# EAGLE design bicyclelab-manager-v4.0 (EAGLE 6.5.0)
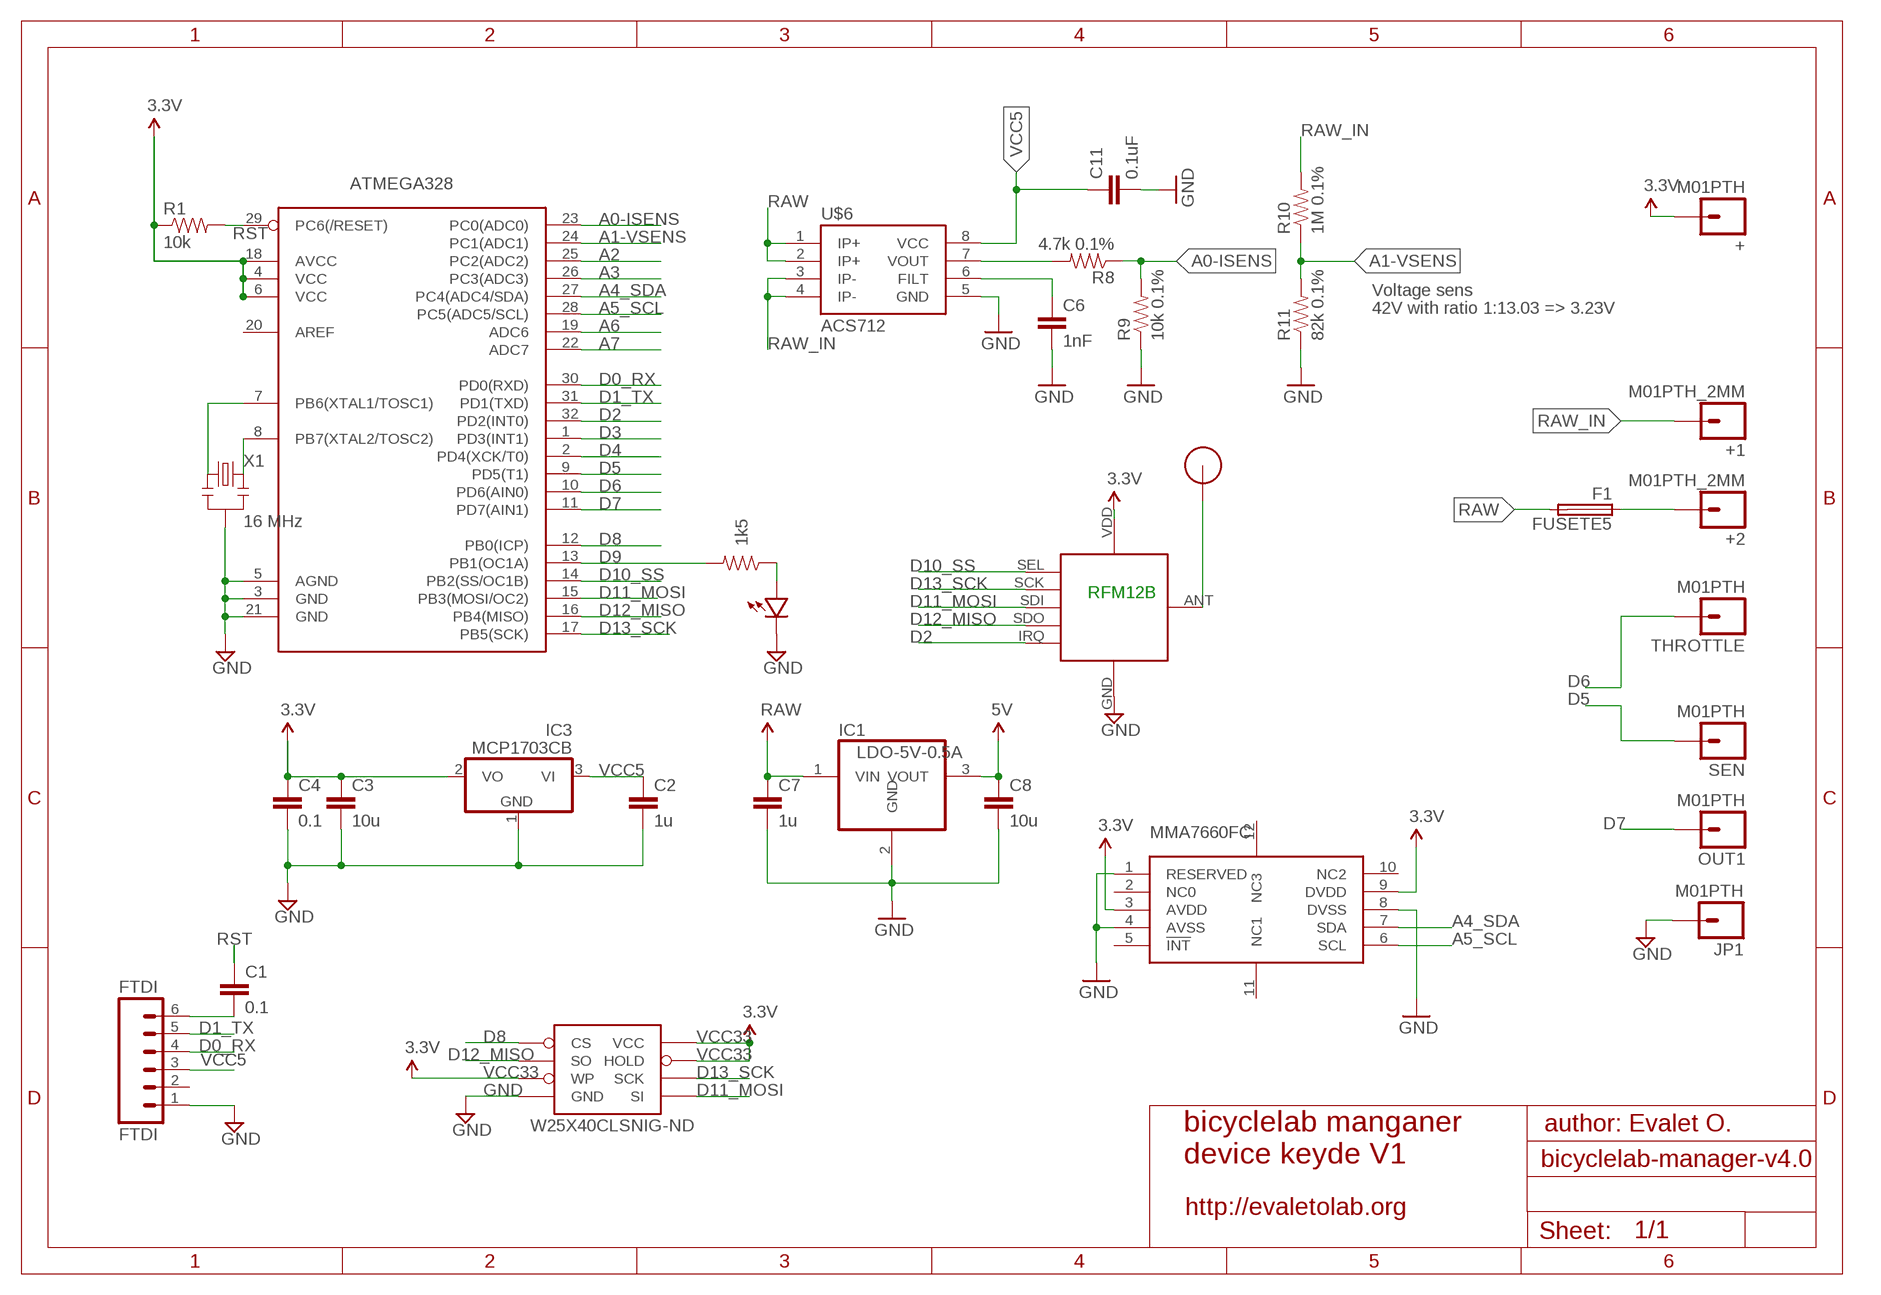
[diagram p0: schematic, sheet 1]

## Parts
+  M01PTH  [1X01]
+1  M01PTH_2MM  [1X01_2MM]
+2  M01PTH_2MM  [1X01_2MM]
ATMEGA328  ATMega-328  ATMEGA168/328TQFP32  [TQFP32-08]
C1  0.1  CAP0603-CAP  [0603-CAP]
C2  1u  CAP0603-CAP  [0603-CAP]
C3  10u  CAP0805-CAP  [0805-CAP]
C4  0.1  CAP0603-CAP  [0603-CAP]
C6  1nF  CAP0805  [0805]
C7  1u  CAP0603-CAP  [0603-CAP]
C8  10u  CAP0805-CAP  [0805-CAP]
C11  0.1uF  CAP0805  [0805]
F1  FUSETE5  [TE5]
FTDI  FTDI  M06SIP  [1X06]
IC1  LDO-5V-0.5A  [SOT223]
IC3  MCP1703CB  [SOT23]
JP1  M01PTH  [1X01]
MMA7660FC  MMA7660FC-DFN10  [DFN10]
OUT1  M01PTH  [1X01]
R1  10k  RESISTOR0603-RES  [0603-RES]
R2  1k5  RESISTOR0603-RES  [0603-RES]
R8  4.7k 0.1%  RESISTOR  [0805]
R9  10k 0.1%  RESISTOR  [0805]
R10  1M 0.1%  RESISTOR  [0805]
R11  82k 0.1%  RESISTOR  [0805]
RFM12B  RFM12B_MINPADS  [RFM12B-MINPADS]
SEN  M01PTH  [1X01]
THROTTLE  M01PTH  [1X01]
U$1  RFM12B_ANTENNA  [RFM12B-ANTENNA]
U$2  LED0603  [0603-LED]
U$6  ACS712  [SO08]
W25X40CLSNIG-ND  AT25F512BWIDE_5.3MM  [SO08WIDE]
X1  16 MHz  RESONATORSMD  [RESONATOR-SMD]

## Nets
A0-ISENS: ATMEGA328.23(PC0(ADC0)) R8.1 R9.2
A1-VSENS: ATMEGA328.24(PC1(ADC1)) R10.1 R11.2
A2: ATMEGA328.25(PC2(ADC2))
A3: ATMEGA328.26(PC3(ADC3))
A4_SDA: ATMEGA328.27(PC4(ADC4/SDA)) MMA7660FC.7(SDA)
A5_SCL: ATMEGA328.28(PC5(ADC5/SCL)) MMA7660FC.6(SCL)
A6: ATMEGA328.19(ADC6)
A7: ATMEGA328.22(ADC7)
D0_RX: ATMEGA328.30(PD0(RXD)) FTDI.4
D1_TX: ATMEGA328.31(PD1(TXD)) FTDI.5
D2: ATMEGA328.32(PD2(INT0)) RFM12B.IRQ
D3: ATMEGA328.1(PD3(INT1))
D4: ATMEGA328.2(PD4(XCK/T0))
D5: ATMEGA328.9(PD5(T1)) SEN.1
D6: ATMEGA328.10(PD6(AIN0)) THROTTLE.1
D7: ATMEGA328.11(PD7(AIN1)) OUT1.1
D8: ATMEGA328.12(PB0(ICP)) W25X40CLSNIG-ND.1(CS)
D9: ATMEGA328.13(PB1(OC1A)) R2.2
D10_SS: ATMEGA328.14(PB2(SS/OC1B)) RFM12B.SEL
D11_MOSI: ATMEGA328.15(PB3(MOSI/OC2)) RFM12B.SDI(SDI/MOSI) W25X40CLSNIG-ND.5(SI)
D12_MISO: ATMEGA328.16(PB4(MISO)) RFM12B.SDO(SDO/MISO) W25X40CLSNIG-ND.2(SO)
D13_SCK: ATMEGA328.17(PB5(SCK)) RFM12B.SCK W25X40CLSNIG-ND.6(SCK)
GND [power]: ATMEGA328.3(GND) ATMEGA328.5(AGND) ATMEGA328.21(GND) C2.2 C3.2 C4.2 C6.2 C7.2 C8.2 C11.2 FTDI.1 IC1.2(GND) IC3.1(GND) JP1.1 MMA7660FC.1(RESERVED) MMA7660FC.4(AVSS) MMA7660FC.8(DVSS) R9.1 R11.1 RFM12B.GND U$2.MINUS U$6.5(GND) W25X40CLSNIG-ND.4(GND) X1.2
IOUT_: R8.2 U$6.7(VOUT)
N$1: ATMEGA328.7(PB6(XTAL1/TOSC1)) X1.1
N$2: R2.1 U$2.PLUS
N$3: RFM12B.ANT U$1.P$1
N$4: C6.1 U$6.6(FILT)
N$20: C1.2 FTDI.6
N$21: ATMEGA328.8(PB7(XTAL2/TOSC2)) X1.3
RAW: C7.1 F1.2 IC1.1(VIN) U$6.1(IP+) U$6.2(IP+)
RAW_IN: +1.1 R10.2 U$6.3(IP-) U$6.4(IP-)
RAW_OUT: +2.1 F1.1
RST: ATMEGA328.29(PC6(/RESET)) C1.1 R1.2
VCC5: C2.1 C8.1 C11.1 FTDI.3 IC1.3(VOUT) IC3.3(VI) U$6.8(VCC) ; supply symbol labelled 5V
VCC33: +.1 ATMEGA328.4(VCC) ATMEGA328.6(VCC) ATMEGA328.18(AVCC) C3.1 C4.1 IC3.2(VO) MMA7660FC.3(AVDD) MMA7660FC.9(DVDD) R1.1 RFM12B.VDD W25X40CLSNIG-ND.3(WP) W25X40CLSNIG-ND.7(HOLD) W25X40CLSNIG-ND.8(VCC) ; supply symbol labelled 3.3V
Unconnected: ATMEGA328.20(AREF) FTDI.2 MMA7660FC.2(NC0) MMA7660FC.5(!INT) MMA7660FC.10(NC2) MMA7660FC.11(NC1) MMA7660FC.12(NC3)

## Notes on the sheet
- Voltage sens
- 42V with ratio 1:13.03 => 3.23V
- RFM12B
- author: Evalet O.
- bicyclelab manganer
  device keyde V1
- http://evaletolab.org

## Library data of the parts
+ +1 +2 JP1 OUT1 SEN THROTTLE = SparkFun-Connectors:M01: Header 1 Standard 1-pin 0.1" header. Use with straight break away headers (SKU : PRT-00116), right angle break away headers (PRT-00553), swiss pins (PRT-00743), machine pins (PRT-00117), and female headers (PRT-00115).
ATMEGA328 = LowPowerLab:ATMEGA168/328: Atmel 32-pin 8-bit micro, 16k flash.
C1-C4 C7 C8 = LowPowerLab:CAP: Capacitor Standard 0603 ceramic capacitor, and 0.1" leaded capacitor.
C6 C11 = SparkFun:CAP: Capacitor Standard 0603 ceramic capacitor, and 0.1" leaded capacitor.
F1 = fuse:FUSE: Fuse; OC_FARNELL: unknown; OC_NEWARK: unknown
FTDI = SparkFun-Connectors:M06: Header 6 Standard 6-pin 0.1" header. Use with straight break away headers (SKU : PRT-00116), right angle break away headers (PRT-00553), swiss pins (PRT-00743), machine pins (PRT-00117), and female headers (PRT-00115). Molex polarized connector foot print use with SKU : PRT-08094 with associated crimp pins and housings. NOTES ON THE VARIANTS LOCK and LOCK_LONGPADS... This footprint was designed to help hold the alignment of a through-hole component (i.e. 6-pin header) while soldering it into place. You may notice that each hole has been shifted either up or down by 0.005 of an inch from it's more standard position (which is a perfectly straight line). This slight alteration caused the pins (the squares in the middle) to touch the edges of the holes. Because they are alternating, it causes a "brace" to hold the component in place. 0.005 has proven to be the perfect amount of "off-center" position when using our standard breakaway headers. Although looks a little odd when you look at the bare footprint, once you have a header in there, the alteration is very hard to notice. Also, if you push a header all the way into place, it is covered up entirely on the bottom side. This idea of altering the position of holes to aid alignment will be further integrated into the Sparkfun Library for other footprints. It can help hold any component with 3 or more connection pins.
IC1 = bicyclelab:LDO-5V-0.5A: 500mA Low Dropout (LDO) Positive Regulator 3.3V, 5V; MODEL1: uA78M00; MODEL2: SPX2945M3
IC3 = linear:MCP1703: 250 mA, 16V, Low Quiescent Current LDO Regulator Source: http://ww1.microchip.com/downloads/en/DeviceDoc/22049b.pdf
MMA7660FC = sd-IC:MMA7660FC: http://search.digikey.com/scripts/DkSearch/dksus.dll?Detail&name=MMA7660FCT-ND
R1 R2 = LowPowerLab:RESISTOR: Resistor
R8-R11 = SparkFun:RESISTOR: Resistor
RFM12B = LowPowerLab:RFM12B_MINPADS
U$1 = LowPowerLab:RFM12B_ANTENNA
U$2 = LowPowerLab:LED
U$6 = SparkFun:ACS712
W25X40CLSNIG-ND = LowPowerLab:AT25F512B: 4-Mbit SPI flash memory
X1 = SparkFun:RESONATOR: Resonator Small SMD resonator. This is the itty bitty 10/20MHz resonators with built in caps. CSTCE10M0G55 and CSTCE20M0V53. Footprint has been reviewed closely but hasn't been tested yet.

## Net classes
1 power: width 0.381 mm, clearance 0.254 mm

## Board
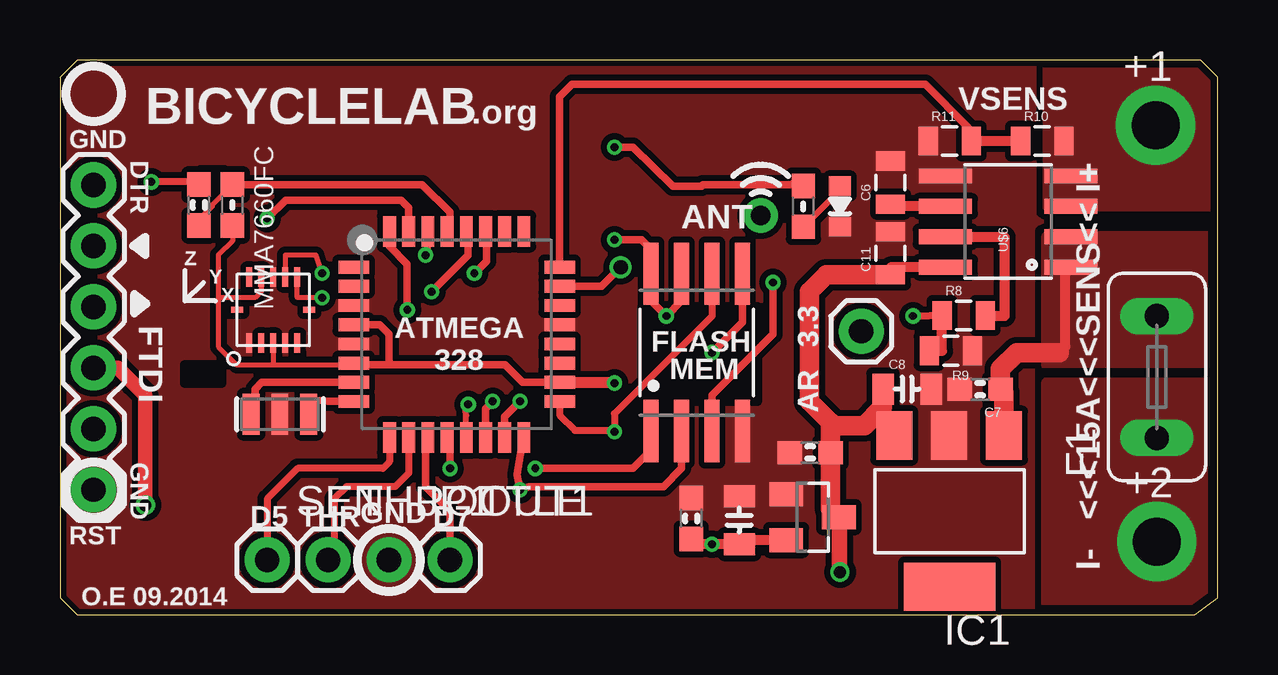
[diagram p1: board, top side]
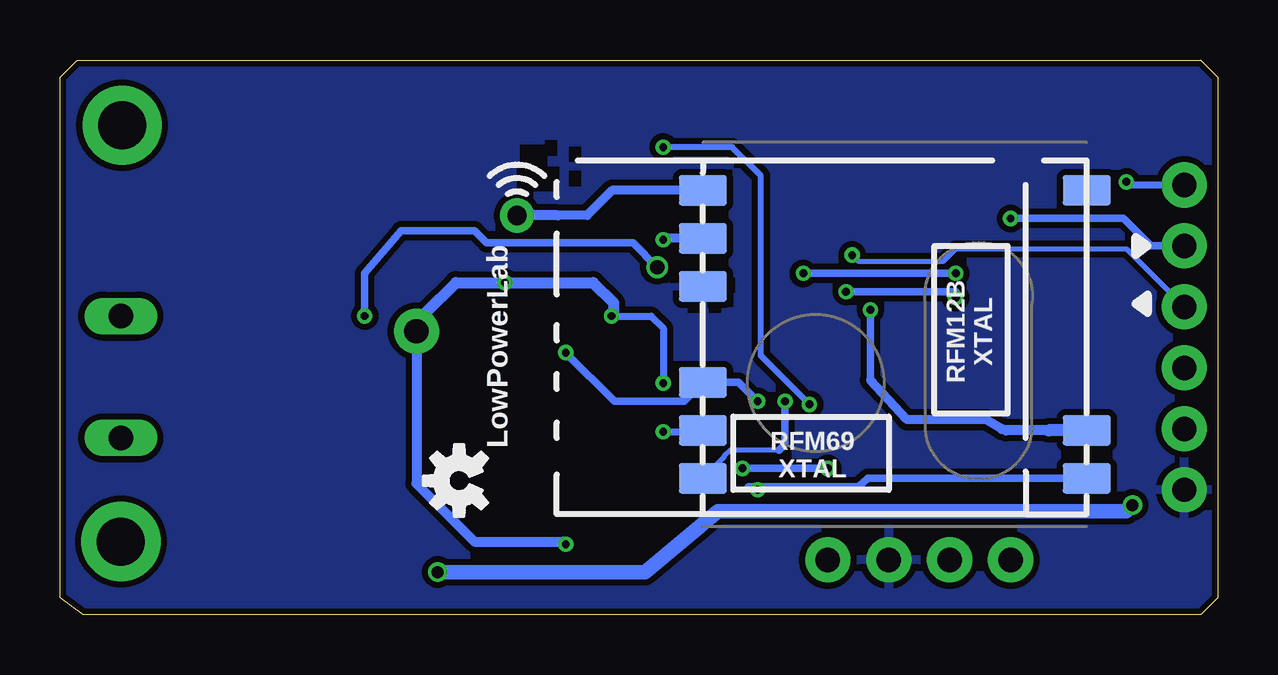
[diagram p2: board, bottom side, seen from below]

Size 48.26 x 23.11 mm. Coordinates in mm from the lower left corner, seen from the top.
Outline: 0.71,0 47.3,0 48.26,0.71 48.26,22.4 47.55,23.11 0.71,23.11 0,22.4 0,0.71 0.71,0
Copper layers (1*16): Top 0.035mm / dielectric 1.5mm / Bottom 0.035mm
Design rules "Fusion_eagle_rule_v1.1": minimum track width 6mil, minimum drill 12mil, track to track 6mil, track to pad 6mil, pad to pad 6mil, via to via 6mil, smd to smd 0mil, copper to edge 10mil, drill to drill 10mil, minimum pad ring 10mil, minimum via ring 6mil, stop-mask expansion 2mil, vias tented up to drill 100mil, thermal gap 10mil
tRestrict: area 24.3,8.9 to 29.1,12.8; area 5.8,16.9 to 6.9,18.5; area 5.2,9.7 to 6.7,10.4
bRestrict: area 27.4,17.7 to 29.2,18.7; area 21.1,13.8 to 22.9,14.9; area 21.6,12.6 to 22.1,13.2; area 20.7,12.6 to 21.2,13.2; area 20.2,12.8 to 20.7,13.5; area 20.1,13.4 to 20.6,14; area 26.5,18.9 to 27.1,19.5; area 26.5,17.9 to 27.1,18.5; area 27.5,19.1 to 28,19.8; area 27.9,18.8 to 29.1,19.6

### Footprints (pad centres in the part's own frame; a part is rotated, then mirrored left to right if it is on the bottom)
1X01 = drill 1.016 pad 1.88: 1 0,0
1X01_2MM = drill 2 pad 3.302: 1 0,0
TQFP32-08 = smd 1.27 x 0.533: 1 -4.293,2.8; 2 -4.293,2; 3 -4.293,1.2; 4 -4.293,0.4; 5 -4.293,-0.4; 6 -4.293,-1.2; 7 -4.293,-2; 8 -4.293,-2.8; 17 4.293,-2.8; 18 4.293,-2; 19 4.293,-1.2; 20 4.293,-0.4; 21 4.293,0.4; 22 4.293,1.2; 23 4.293,2; 24 4.293,2.8 | smd 0.533 x 1.27: 9 -2.8,-4.293; 10 -2,-4.293; 11 -1.2,-4.293; 12 -0.4,-4.293; 13 0.4,-4.293; 14 1.2,-4.293; 15 2,-4.293; 16 2.8,-4.293; 25 2.8,4.293; 26 2,4.293; 27 1.2,4.293; 28 0.4,4.293; 29 -0.4,4.293; 30 -1.2,4.293; 31 -2,4.293; 32 -2.8,4.293
0603-CAP = smd 1.016 x 0.965: 1 -0.85,0; 2 0.85,0
0805-CAP = smd 0.902 x 1.3: 1 -1,0; 2 1,0
0805 = smd 0.8 x 1.2: 1 -0.9,0; 2 0.9,0
TE5 = drill 1.016 long: 1 -2.54,0; 2 2.54,0
1X06 = drill 1.016 pad 1.88: 1 0,0; 2 2.54,0; 3 5.08,0; 4 7.62,0; 5 10.16,0; 6 12.7,0
SOT223 = smd 1.499 x 2.007: 1 -2.261,-3.15; 2 0.025,-3.15; 3 2.311,-3.15 | smd 3.81 x 2.007: 4 0,3.15
SOT23 = smd 1 x 1.4: 1 -0.95,-1.1; 2 0.95,-1.1; 3 0,1.1
DFN10 = smd 0.8 x 0.25: 1 -1.375,1; 2 -1.375,0.5; 3 -1.375,0; 4 -1.375,-0.5; 5 -1.375,-1; 6 1.375,-1; 7 1.375,-0.5; 8 1.375,0; 9 1.375,0.5; 10 1.375,1 | smd 0.25 x 0.5: 11 0,-1.5; 12 0,1.5
0603-RES = smd 1.016 x 0.965: 1 -0.85,0; 2 0.85,0
RFM12B-MINPADS = smd 2 x 1.27: ANT 8,-6; GND 8,-2; IRQ -8,4; SCK 8,4; SDI 8,2; SDI1 -8.002,-6.001; SDO -8,6; SEL 8,6; VDD 8,-4
RFM12B-ANTENNA = drill 0.8 pad 1.422: P$1 0,0
0603-LED = smd 0.8 x 0.9: MINUS -0.85,0; PLUS 0.85,0
SO08 = smd 0.61 x 2.21: 1 -1.905,-2.616; 2 -0.635,-2.616; 3 0.635,-2.616; 4 1.905,-2.616; 5 1.905,2.616; 6 0.635,2.616; 7 -0.635,2.616; 8 -1.905,2.616
SO08WIDE = smd 0.61 x 2.6: 1 -1.905,-3.269; 2 -0.635,-3.269; 3 0.635,-3.269; 4 1.905,-3.269; 5 1.905,3.286; 6 0.635,3.286; 7 -0.635,3.286; 8 -1.905,3.286
RESONATOR-SMD = smd 0.7 x 1.7: 1 -1.2,0; 2 0,0; 3 1.2,0

### Placement (x,y rotation side)
+  33.4,11.81 270 top
+1  45.67,20.4 0 top
+2  45.72,3.05 0 top
ATMEGA328  16.54,11.68 0 top
C1  5.79,17.07 90 top
C2  31.27,6.76 180 top
C3  28.32,3.94 90 top
C4  26.31,4.01 90 top
C6  34.62,18.01 90 top
C7  38.35,9.4 180 top
C8  35.31,9.4 0 top
C11  34.62,15.06 90 top
F1  45.72,9.91 90 top
FTDI  1.4,5.21 90 top
IC1  37.08,4.32 180 top
IC3  31.37,4.06 270 top
JP1  13.72,2.29 0 top
MMA7660FC  8.89,12.7 90 top
OUT1  16.26,2.29 0 top
R1  7.19,17.07 90 top
R2  30.99,17.02 90 top
R8  37.67,12.47 0 top
R9  37.13,11 180 top
R10  40.94,19.74 0 top
R11  37.08,19.74 0 top
RFM12B  13.46,11.68 180 bottom
SEN  8.64,2.29 0 top
THROTTLE  11.18,2.29 0 top
U$1  29.21,16.64 0 top
U$2  32.51,17.02 90 top
U$3  [OSHW-LOGO-S]  31.62,5.59 90 bottom
U$6  39.52,16.38 90 top
W25X40CLSNIG-ND  26.54,10.92 0 top
X1  9.17,8.36 0 top

### Tracks (layer width: path | path; a pad name or v marks a point on that pad's centre or on a via)
A0-ISENS  (via drill 0.33, 0.6)
  Top 0.305: ATMEGA328.23 22.57,13.68 v23.37,14.48 | v35.56,12.45 35.73,12.45 R8.1
  Top 0.406: R9.2 36.77,11 R8.1
  Bottom 0.305: v23.37,14.48 24.38,15.49 30.48,15.49 30.99,16 34.04,16 35.56,14.22 v35.56,12.45
A1-VSENS
  Top 0.305: R11.2 37.85,19.87 37.85,20.32 36.07,22.1 21.34,22.1 20.83,21.59 ATMEGA328.24
  Top 0.406: R10.1 R11.2
A4_SDA  (via drill 0.33)
  Top 0.2: v10.92,14.22 10.67,14.99 9.4,14.99 9.39,14.98 MMA7660FC.7
  Top 0.305: ATMEGA328.27 17.78,15.93 17.78,14.73 v17.27,14.22
  Bottom 0.305: v17.27,14.22 v10.92,14.22
A5_SCL  (via drill 0.33)
  Top 0.2: v10.92,13.21 9.91,13.21 9.89,13.22 MMA7660FC.6
  Top 0.305: ATMEGA328.28 17.02,15.89 17.02,14.99 v15.49,13.46
  Bottom 0.305: v15.49,13.46 10.92,13.46 v10.92,13.21
D0_RX  (via drill 0.33)
  Top 0.2: ATMEGA328.30 15.34,15.08 v15.24,14.99
  Bottom 0.2: v15.24,14.99 14.99,14.73 11.43,14.73 10.92,15.24 3.81,15.24 FTDI.4
D1_TX  (via drill 0.33)
  Top 0.305: ATMEGA328.31 14.54,16.96 14.22,17.27 9.4,17.27 v8.64,16.51
  Bottom 0.305: FTDI.5 2.79,15.37 3.94,16.51 8.38,16.51 v8.64,16.51
D2  (via drill 0.33)
  Top 0.305: 13.72,15.83 13.72,15.37 14.48,14.61 v14.48,12.7
  Top 0.381: 13.72,15.83 ATMEGA328.32
  Bottom 0.305: v14.48,12.7 14.48,9.78
  Bottom 0.381: 9.02,7.75 9.65,8.13 12.95,8.13 14.48,9.78
  Bottom 0.406: 7.06,7.68 8.83,7.68 9.02,7.75
  Bottom 0.508: RFM12B.IRQ 7.06,7.68
D5
  Top 0.3: ATMEGA328.9 13.73,6.37 13.46,6.1 9.91,6.1 8.64,4.83 SEN.1
D6
  Top 0.3: ATMEGA328.10 14.54,5.9 13.97,5.33 11.94,5.33 11.43,4.83 11.43,2.29 THROTTLE.1
D7
  Top 0.305: ATMEGA328.11 15.24,7.3 15.24,5.33 16.26,4.32 OUT1.1
D8  (via drill 0.33)
  Top 0.305: W25X40CLSNIG-ND.1 24.64,6.86 23.88,6.1 v19.81,6.1 | v16.26,6.1 16.26,7.27 ATMEGA328.12
  Bottom 0.305: v19.81,6.1 v16.26,6.1
D9  (via drill 0.33)
  Top 0.254: ATMEGA328.13 16.93,8.3 16.89,8.76 v17.02,8.76
  Top 0.305: R2.2 30.77,18.12 30.48,17.91 26.8,17.91 26.75,17.86 25.55,17.86 23.88,19.48 v23.11,19.48
  Bottom 0.254: v17.02,8.76 19.05,10.79 19.05,18.29 20.24,19.48 v23.11,19.48
D10_SS  (via drill 0.33)
  Top 0.305: ATMEGA328.14 17.73,8.59 v18.03,8.89
  Bottom 0.2: 18.29,6.86 20.32,6.86 20.57,6.6 20.57,6.57 RFM12B.SEL
  Bottom 0.305: v18.03,8.89 18.03,7.11 18.29,6.86
D11_MOSI  (via drill 0.33)
  Top 0.305: ATMEGA328.15 18.54,8.25 v19.18,8.89 | W25X40CLSNIG-ND.5 28.45,12.19 v27.18,10.92
  Bottom 0.305: v19.18,8.89 19.97,9.68 RFM12B.SDI 22.26,8.89 25.15,8.89 v27.18,10.92
D12_MISO  (via drill 0.33)
  Top 0.305: W25X40CLSNIG-ND.2 25.91,6.1 25.15,5.33 19.56,5.33 v19.18,5.21 19.05,5.84 19.3,7.36 ATMEGA328.16
  Bottom 0.305: RFM12B.SDO 14.57,5.68 14.99,5.33 19.56,5.33 v19.18,5.21
D13_SCK  (via drill 0.33)
  Top 0.3: W25X40CLSNIG-ND.6 27.18,12.45 23.11,8.38 v23.11,7.62 23.05,7.68 RFM12B.SCK 20.83,8.32 ATMEGA328.17
  Bottom 0.3: v23.11,7.62 21.53,7.62 RFM12B.SCK
GND
  pour Bottom: -0.64,24 -0.64,-0.76 48.77,-0.76 48.77,24
  pour Top (isolate 0.2, rank 3, no thermals): -0.64,24 -0.64,-0.76 48.77,-0.76 48.77,24
IOUT_
  Top 0.406: U$6.7 39.37,15.75 39.37,12.45 38.57,12.45 R8.2
N$1
  Top 0.305: ATMEGA328.7 8.41,9.68 8.13,9.4 8.13,8.77 X1.1
N$2
  Top 0.254: R2.1 32.38,17.57 U$2.PLUS
N$3
  Bottom 0.381: 28.5,16.68 U$1.P$1 | RFM12B.ANT 25.24,17.68 26.29,16.64 27.51,16.64
  Bottom 0.406: 27.51,16.64 U$1.P$1
N$4
  Top 0.406: U$6.6 34.62,17.02 C6.1
N$20  (via drill 0.33)
  Top 0.3: 5.78,17.91 5.65,18.03 v3.81,18.03
  Top 0.305: 5.78,17.91 C1.2
  Bottom 0.3: v3.81,18.03 3.68,17.91 FTDI.6
N$21
  Top 0.305: X1.3 10.62,8.94 11.18,8.89 ATMEGA328.8
RAW
  Top 0.305: 39.34,9.26 C7.1
  Top 0.406: 41.66,10.92 41.91,11.18 41.91,14.25 U$6.1
  Top 0.813: IC1.1 39.34,9.26 | C7.1 39.2,10.25 39.88,10.92 41.66,10.92
  pour Top (isolate 0.405, rank 2, no thermals): 41.15,15.75 49.28,15.75 49.28,10.41 41.15,10.41
RAW_IN
  pour Top (isolate 0.305, no thermals): 41.15,23.11 41.15,17.02 48.77,17.02 48.77,23.11
RAW_OUT
  pour Top (isolate 0.405, no thermals): 41.15,9.65 49.28,9.65 49.28,-1.52 41.15,-1.52
RST
  Top 0.2: 5.79,16.46 6.35,17.02 6.35,17.08 R1.2
  Top 0.305: C1.1 5.79,16.46 | R1.2 15.1,17.92 16.26,16.76 16.26,16.1 ATMEGA328.29
VCC5  (via drill 0.5)
  Top 0.305: IC1.3 34.77,8.15 34.29,8.64 34.29,9.38 C8.1
  Top 0.406: U$6.8 34.62,14.48 C11.1 | 32.51,4.02 IC3.3 | v32.51,1.78 32.47,1.82
  Top 0.6: FTDI.3 2.41,10.29 3.05,9.65 3.56,9.14 v3.56,4.57 | v32.51,1.78 32.51,4.02 | 32.47,1.82 IC3.3
  Top 0.813: IC3.3 32.12,4.42 C2.1 32.12,7.87 | C11.1 31.94,14.16 31.24,13.46 31.24,8.89 32.12,8.02 32.12,7.87 | 34.29,8.64 33.53,7.87 32.12,7.87
  Bottom 0.6: v3.56,4.57 3.81,4.32 20.83,4.32 23.88,1.78 v32.51,1.78
VCC33  (via drill 0.33)
  Top 0.2: R1.1 7.19,15.57 6.6,14.99 6.6,13.21 | 6.6,13.21 6.6,11.18 7.37,10.41 8.89,10.41 | 8.89,10.41 12.17,10.41 ATMEGA328.6 | MMA7660FC.3 8.89,10.41 | MMA7660FC.9 8.39,13.47 8.13,13.21 6.6,13.21
  Top 0.305: W25X40CLSNIG-ND.7 25.91,13.08 v25.27,12.45 24.64,13.08 W25X40CLSNIG-ND.8 | v23.11,15.62 24.24,15.62 24.64,15.22 | ATMEGA328.18 19.27,9.68 18.54,10.41 13.72,10.41 | 13.72,10.41 12.31,10.41 ATMEGA328.6 | ATMEGA328.4 13.32,12.08 13.72,11.68 13.72,10.41 | W25X40CLSNIG-ND.3 27.18,9.14 29.72,11.68 v29.72,13.84
  Top 0.381: 24.64,15.22 W25X40CLSNIG-ND.8
  Top 0.406: IC3.2 28.5,3.11 C3.1 v27.18,2.94 26.8,2.94 C4.1
  Top 0.457: ATMEGA328.18 23.21,9.68 v23.11,9.65
  Bottom 0.3: v25.27,12.45 23.62,12.45 23.11,11.94 v23.11,9.65
  Bottom 0.305: 27.29,3.05 v27.18,2.94
  Bottom 0.381: RFM12B.VDD 23.18,15.68 v23.11,15.62
  Bottom 0.406: +.1 33.4,5.46 30.99,3.05 27.29,3.05
  Bottom 0.457: +.1 33.02,12.57 31.75,13.84 v29.72,13.84 26.04,13.84 25.18,12.99 25.18,12.54 v25.27,12.45

### Text on the board
tPlace: BICYCLELAB | .org
bPlace: RFM12B / XTAL | LowPowerLab | RFM69 / XTAL
tDocu: REG
_tsilk: VSENS | GND | DTR | ANT | Z | Y | X | 3.3 | FLASH | ATMEGA / 328 | MEM | AR | FTDI | GND | D5 | THR | GND | D7 | RST | I- <<<15A<<<SENS<< I+ | O.E 09.2014
_bsilk: VIN | 3.3 | 1 | 0 | A7 | A6 | A5 | A4 | A3 | A2 | A1 | A0 | GND | DTR | ANT | VIN | GND | 2 | 3 | 4 | 5 | 6 | 7 | 8 | 9 | 10 | 11 | 12 | 13 | RST